# Altium project ShieldBBGaliV.PrjPcb
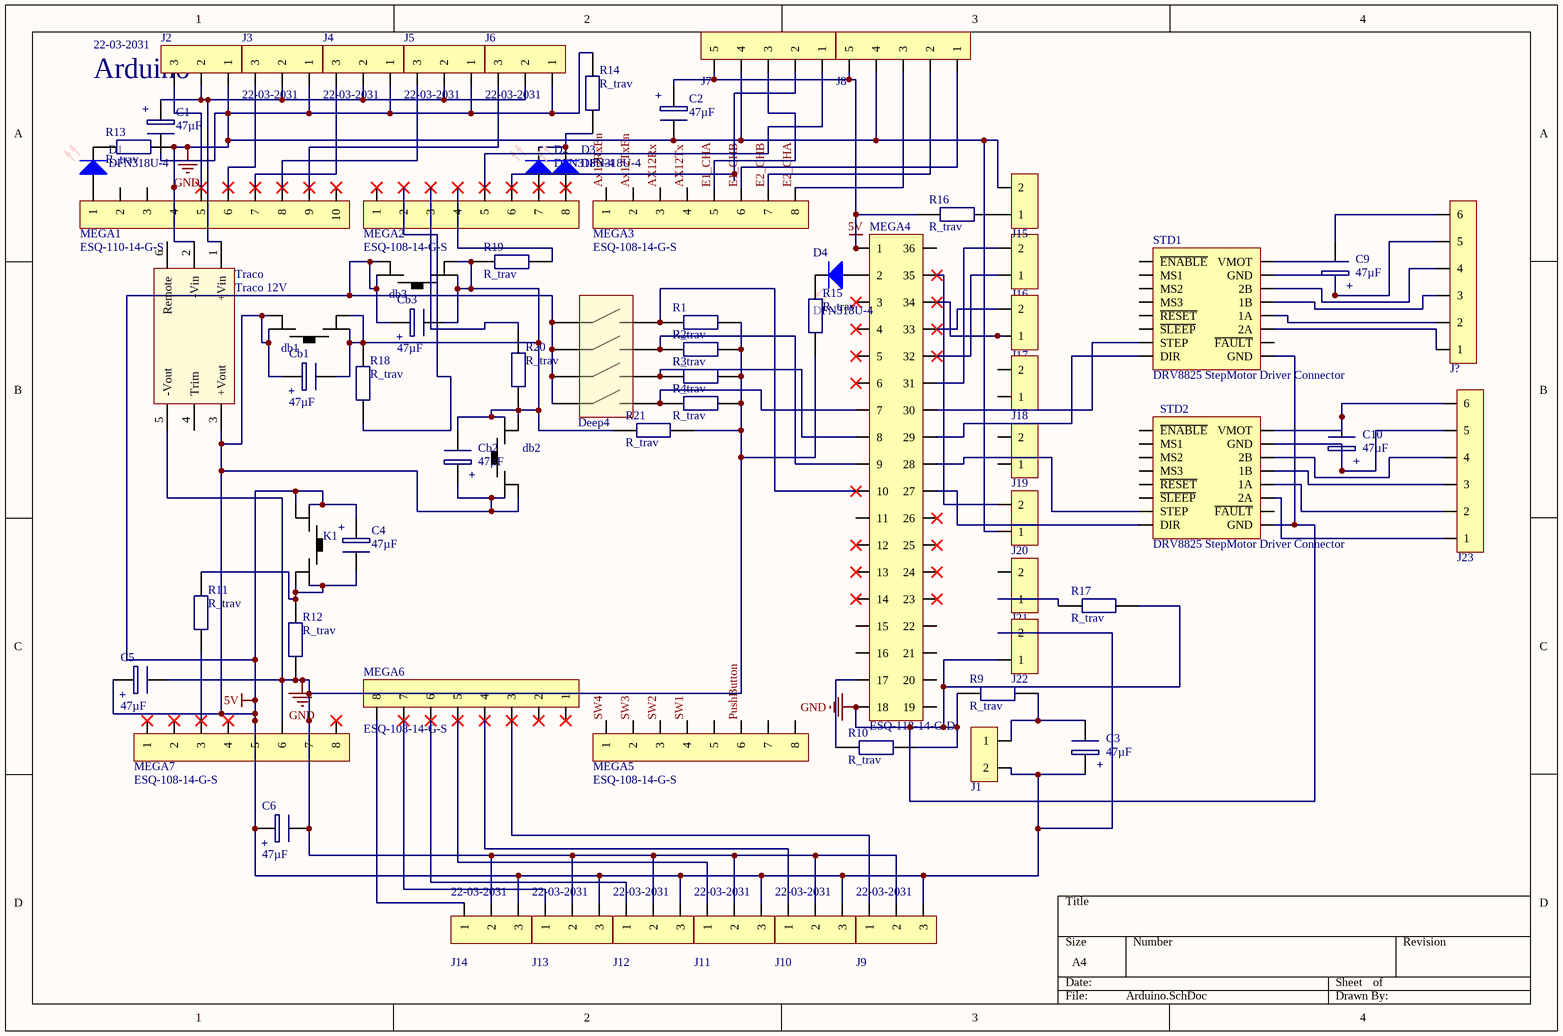
[diagram p0: Arduino.SchDoc]
2 sheets, 98 parts. Net scope: global (net labels, ports and power ports of the same name join across sheets).
Board file: ShieldBBGaliV.PcbDoc
Sheets:
  Arduino.SchDoc
  ActionneursCapteurs.SchDoc

## Sheet Arduino.SchDoc
size A4

### Parts
(Parts that share a designator on the sheet are numbered #1, #2 ... from top to bottom, then left to right.)
C1#1  47µF  [C_5mm]
C2#1  47µF  [C_5mm]
C3#1  47µF  [C_5mm]
C4#1  47µF  [C_5mm]
C5#1  47µF  [C_5mm]
C6#1  47µF  [C_5mm]
C9  47µF  [C_5mm]
C10  47µF  [C_5mm]
Cb1  47µF  [C_5mm]
Cb2  47µF  [C_5mm]
Cb3  47µF  [C_5mm]
D1  DFN318U-4  [DEL]
D2  DFN318U-4  [DEL]
D3  DFN318U-4  [DEL]
D4  DFN318U-4  [DEL]
db1  B3F-1000  [B3F-1000]  (value not drawn)
db2  B3F-1000  [B3F-1000]  (value not drawn)
db3  B3F-1000  [B3F-1000]  (value not drawn)
Deep4  DILx4  [DILx4]  (value not drawn)
J1  22-03-2021  [22-03-2021]  (value not drawn)
J2  22-03-2031  [22-03-2031]
J3  22-03-2031  [22-03-2031]
J4  22-03-2031  [22-03-2031]
J5  22-03-2031  [22-03-2031]
J6  22-03-2031  [22-03-2031]
J7  22-03-2051  [22-03-2051]  (value not drawn)
J8  22-03-2051  [22-03-2051]  (value not drawn)
J9  22-03-2031  [22-03-2031]
J10  22-03-2031  [22-03-2031]
J11  22-03-2031  [22-03-2031]
J12  22-03-2031  [22-03-2031]
J13  22-03-2031  [22-03-2031]
J14  22-03-2031  [22-03-2031]
J15  22-03-2021  [22-03-2021]  (value not drawn)
J16  22-03-2021  [22-03-2021]  (value not drawn)
J17  22-03-2021  [22-03-2021]  (value not drawn)
J18  22-03-2021  [22-03-2021]  (value not drawn)
J19  22-03-2021  [22-03-2021]  (value not drawn)
J20  22-03-2021  [22-03-2021]  (value not drawn)
J21  22-03-2021  [22-03-2021]  (value not drawn)
J22  22-03-2021  [22-03-2021]  (value not drawn)
J23  22-03-2061  [22-03-2061]  (value not drawn)
J?  22-03-2061  [22-03-2061]  (value not drawn)
K1  B3F-1000  [B3F-1000]  (value not drawn)
MEGA1  ESQ-110-14-G-S  [ESQ-110-14-G-S]
MEGA2  ESQ-108-14-G-S  [ESQ-108-14-G-S]
MEGA3  ESQ-108-14-G-S  [ESQ-108-14-G-S]
MEGA4  ESQ-118-14-G-D  [ESQ-118-14-G-D]
MEGA5  ESQ-108-14-G-S  [ESQ-108-14-G-S]
MEGA6  ESQ-108-14-G-S  [ESQ-108-14-G-S]
MEGA7  ESQ-108-14-G-S  [ESQ-108-14-G-S]
R1#1  R_trav  [R_250mW_trav]
R2#1  R_trav  [R_250mW_trav]
R3#1  R_trav  [R_250mW_trav]
R4#1  R_trav  [R_250mW_trav]
R9  R_trav  [R_250mW_trav]
R10  R_trav  [R_250mW_trav]
R11  R_trav  [R_250mW_trav]
R12  R_trav  [R_250mW_trav]
R13#1  R_trav  [R_250mW_trav]
R14#1  R_trav  [R_250mW_trav]
R15#1  R_trav  [R_250mW_trav]
R16#1  R_trav  [R_250mW_trav]
R17  R_trav  [R_250mW_trav]
R18  R_trav  [R_250mW_trav]
R19  R_trav  [R_250mW_trav]
R20  R_trav  [R_250mW_trav]
R21  R_trav  [R_250mW_trav]
STD1  DRV8825 StepMotor Driver Connector  [A4988_Connector_PCB]
STD2  DRV8825 StepMotor Driver Connector  [A4988_Connector_PCB]
Traco  Traco 12V  [THL10WI]

### Nets
5V: C2#1.2 C3#1.2 C4#1.2 C5#1.2 C6#1.2 Cb1.2 Cb2.2 Cb3.2 db1.2 db1.4 db2.1 db2.3 db3.2 db3.4 Deep4.1 Deep4.3 Deep4.5 Deep4.7 J1.2 J7.5 J8.5 J9.3 J10.3 J11.3 J12.3 J13.3 J14.3 J22.2 K1.1 K1.3 MEGA4.1 MEGA7.5 R16#1.2 Traco.3(+Vout)
GND: C1#1.1 C2#1.1 C5#1.1 C6#1.1 J2.1 J3.1 J4.1 J5.1 J6.1 J7.4 J8.4 J9.2 J10.2 J11.2 J12.2 J13.2 J14.2 J15.2 J20.1 J22.1 MEGA1.4 MEGA4.18 MEGA7.6 MEGA7.7 R1#1.1 R2#1.1 R3#1.1 R4#1.1 R9.2 R10.1 R12.2 R13#1.1 R14#1.1 R15#1.2 R17.2 R21.1 STD1.4(GND) STD2.4(GND) Traco.2(-Vin) Traco.5(-Vout)
AX12Rx: MEGA3.3
Ax12RxEn: MEGA3.1
AX12Tx: MEGA3.4
Ax12TxEn: MEGA3.2
E1_CHA: J7.3 MEGA3.5
E1_CHB: J8.1 MEGA3.6
E2_CHA: J8.3 MEGA3.8
E2_CHB: J8.2 MEGA3.7
PushButton: MEGA5.6
SW1: MEGA5.4
SW2: MEGA5.3
SW3: MEGA5.2
SW4: MEGA5.1
NetC1#1_2: C1#1.2 J2.2 J3.2 J4.2 J5.2 J6.2 Traco.1(+Vin)
NetC3#1_1: C3#1.1 J1.1 R9.1
NetC4#1_1: C4#1.1 K1.2 K1.4 R11.1 R12.1
NetC9_1: C9.1 J?.6
NetC9_2: C9.2 J?.5 STD1.4(GND)
NetC10_1: C10.1 J23.6 STD2.2(VMOT)
NetC10_2: C10.2 J23.5 STD2.4(GND)
NetCb1_1: Cb1.1 Cb2.1 Cb3.1 db1.1 db1.3 db2.2 db2.4 db3.1 db3.3 R18.2 R19.2 R20.2 R21.2
NetD1_A: D1.A MEGA1.1
NetD1_K: D1.K R13#1.2
NetD2_A: D2.A MEGA2.7
NetD2_K: D2.K D3.K R14#1.2
NetD3_A: D3.A MEGA2.8
NetD4_A: D4.A MEGA4.2
NetD4_K: D4.K R15#1.1
NetDeep4_2: Deep4.2 MEGA4.10 R1#1.2
NetDeep4_4: Deep4.4 MEGA4.9 R2#1.2
NetDeep4_6: Deep4.6 MEGA4.8 R3#1.2
NetDeep4_8: Deep4.8 MEGA4.7 R4#1.2
NetJ2_3: J2.3 MEGA1.5
NetJ3_3: J3.3 MEGA1.6
NetJ4_3: J4.3 MEGA1.7
NetJ5_3: J5.3 MEGA1.8
NetJ6_3: J6.3 MEGA1.9
NetJ7_1: J7.1 MEGA2.5
NetJ7_2: J7.2 MEGA2.6
NetJ9_1: J9.1 MEGA6.3
NetJ10_1: J10.1 MEGA6.4
NetJ11_1: J11.1 MEGA6.5
NetJ12_1: J12.1 MEGA6.6
NetJ13_1: J13.1 MEGA6.7
NetJ14_1: J14.1 MEGA6.8
NetJ15_1: J15.1 R16#1.1
NetJ16_1: J16.1 MEGA4.32
NetJ16_2: J16.2 MEGA4.31
NetJ17_1: J17.1 MEGA4.34
NetJ17_2: J17.2 MEGA4.33
NetJ20_2: J20.2 MEGA4.35
NetJ21_1: J21.1 R17.1
NetJ23_1: J23.1 STD2.12(2A)
NetJ23_2: J23.2 STD2.10(1A)
NetJ23_3: J23.3 STD2.8(1B)
NetJ23_4: J23.4 STD2.6(2B)
NetJ?_1: J?.1 STD1.12(2A)
NetJ?_2: J?.2 STD1.10(1A)
NetJ?_3: J?.3 STD1.8(1B)
NetJ?_4: J?.4 STD1.6(2B)
NetMEGA2_2: MEGA2.2 R18.1
NetMEGA2_3: MEGA2.3 R20.1
NetMEGA2_4: MEGA2.4 R19.1
NetMEGA4_17: MEGA4.17 R10.2
NetMEGA4_27: MEGA4.27 STD2.15(DIR)
NetMEGA4_28: MEGA4.28 STD2.13(STEP)
NetMEGA4_29: MEGA4.29 STD1.15(DIR)
NetMEGA4_30: MEGA4.30 STD1.13(STEP)
NetMEGA7_3: MEGA7.3 R11.2

Not connected (* = marked no-connect by the designer): J18 1 2; J19 1 2; J21 2; MEGA1 2 3 10*; MEGA2 1*; MEGA4 3* 4* 5* 6* 11 12* 13* 14* 15 16 19 20 21 22 23* 24* 25* 26* 36; MEGA5 5 7 8; MEGA6 1* 2*; MEGA7 1* 2* 4* 8*; STD1 1(~{ENABLE}) 2(VMOT) 3(MS1) 5(MS2) 7(MS3) 9(~{RESET}) 11(~{SLEEP}) 14(~{FAULT}); STD2 1(~{ENABLE}) 3(MS1) 5(MS2) 7(MS3) 9(~{RESET}) 11(~{SLEEP}) 14(~{FAULT}); Traco 4(Trim) 6(Remote)

### Notes on the sheet
- (near J2) Arduino
- (in symbol C_47µF) +

### Library data of the parts
C1#1 C2#1 C3#1 C4#1 C5#1 C6#1 C9 C10 Cb1-Cb3 = C_47µF: Manufacturer: PANASONIC; Manufacturer Part Number: ECA1EM470; Supplier 1: Farnell; Supplier Part Number 1: 1848498; Pricing: 5=0.088, 50=0.085, 100=0.058, 500=0.046, 1000=0.039 (EUR); ComponentLink1URL: http://www.farnell.com/datasheets/1678745.pdf; ComponentLink1Description: http://www.farnell.com/datasheets/1678745.pdf; ComponentLink2URL: http://www.farnell.com/cad/1703907.zip; ComponentLink2Description: http://www.farnell.com/cad/1703907.zip
D1-D4 = DFN318U-4: Through-hole IRED / High Speed Type; Courant: 100 mA; Edition: ECE ZODIAC; Fabriquant: STANLEY; Lien GCC: \\Spar-nas\gcc\Fiches-techniques\CMS\Diodes\; Poid: 0.15 g; Prix: 0.8 €; Puissance: 150 mW; Tension: 5 V; Tr: 10 ns; Type: LED IR; Vd: 1.6 V - 2 V; Angle de diffusion: 20°; Pic de longueur d'onde: 850nm; Semi-conducteur: GaAlAs; Puissance lumineuse: 13 mW; Code_IPC: ?; Code_JEDEC: SOT23; Code_JEITA: ?; Date de création: 13-Juin-2006; Derniére révision: 13-Juin-2006; Référence fabriquant: DFN318U-4
db1-db3 K1 = B3F-1000: Manufacturer: OMRON ELECTRONIC COMPONENTS; Manufacturer Part Number: B3F1006; Force, fonctionnement: 4.9; Tension DC nominale du contact: 24; Courant de contact max.: 50; Terminaisons commutateur: A souder; SVHC: No SVHC (20-Jun-2013); Configuration des contacts: SPST-NO; Hauteur: 4.3; Type d'actionnement: Plate<!--FANDB--><div class="features-and-benefits-container"></div>; Supplier 1: Farnell; Supplier Part Number 1: 1960938; Pricing: 1=0.88, 10=0.72, 25=0.6, 50=0.5, 100=0.46, 200=0.414, 200=0.373, 2000=0.263 (EUR); MSL: -; ComponentLink1URL: http://www.farnell.com/datasheets/611570.pdf; ComponentLink1Description: http://www.farnell.com/datasheets/611570.pdf
Deep4 = DILx4: Manufacturer: MULTICOMP; Manufacturer Part Number: MCNDS-04-V; Supplier 1: Farnell; Supplier Part Number 1: 9471570; Pricing: 1=0.81, 50=0.77, 100=0.72, 500=0.62, 1000=0.57 (EUR); ComponentLink1URL: http://www.farnell.com/cad/1520781.pdf; ComponentLink1Description: http://www.farnell.com/cad/1520781.pdf; ComponentLink2URL: http://www.farnell.com/datasheets/1772997.pdf; ComponentLink2Description: http://www.farnell.com/datasheets/1772997.pdf
J1 J15-J22 = 22-03-2021: Manufacturer: MOLEX; Supplier 1: Farnell; Supplier Part Number 1: 9731075; Manufacturer Part Number: 22-03-2021; Pricing: 10=0.189, 100=0.147, 200=0.119, 500=0.108, 1000=0.088, 2500=0.08, 2500=0.0711, 20000=0.064 (EUR); ComponentLink1URL: http://www.farnell.com/cad/1533907.pdf; ComponentLink1Description: http://www.farnell.com/cad/1533907.pdf; ComponentLink2URL: http://www.farnell.com/datasheets/1791308.pdf; ComponentLink2Description: http://www.farnell.com/datasheets/1791308.pdf
J2-J6 J9-J14 = 22-03-2031: Manufacturer: MOLEX; Supplier 1: Farnell; Supplier Part Number 1: 9731083; Manufacturer Part Number: 22-03-2031; Pricing: 10=0.27, 100=0.242, 200=0.22, 500=0.208, 1000=0.202, 2500=0.196 (EUR); ComponentLink1URL: http://www.farnell.com/cad/1533907.pdf; ComponentLink1Description: http://www.farnell.com/cad/1533907.pdf; ComponentLink2URL: http://www.farnell.com/datasheets/1785732.pdf; ComponentLink2Description: http://www.farnell.com/datasheets/1785732.pdf
J7 J8 = 22-03-2051: Manufacturer: MOLEX; Supplier 1: Farnell; Supplier Part Number 1: 9731105; Manufacturer Part Number: 22-03-2051; Pricing: 10=0.43, 100=0.35, 200=0.29, 500=0.26, 1000=0.24, 2500=0.191, 2500=0.172, 20000=0.155 (EUR); ComponentLink1URL: http://www.farnell.com/cad/1533907.pdf; ComponentLink1Description: http://www.farnell.com/cad/1533907.pdf; ComponentLink2URL: http://www.farnell.com/datasheets/1803075.pdf; ComponentLink2Description: http://www.farnell.com/datasheets/1803075.pdf
J23 J? = 22-03-2061: Manufacturer: MOLEX; Supplier 1: Farnell; Supplier Part Number 1: 9731113; Manufacturer Part Number: 22-03-2061; Pricing: 10=0.76, 100=0.7, 200=0.64, 500=0.49, 1000=0.43, 2500=0.31, 2500=0.304, 20000=0.298 (EUR); ComponentLink1URL: http://www.farnell.com/cad/1533907.pdf; ComponentLink1Description: http://www.farnell.com/cad/1533907.pdf; ComponentLink2URL: http://www.farnell.com/datasheets/1791310.pdf; ComponentLink2Description: http://www.farnell.com/datasheets/1791310.pdf
MEGA1 = ESQ-110-14-G-S: Manufacturer: SAMTEC; Supplier 1: Farnell; Supplier Part Number 1: 1769290; Manufacturer Part Number: ESQ-110-14-G-S; Pricing: 5=4.375, 50=3.012, 100=2.35, 250=1.925, 500=1.75, 2500=1.425 (EUR); ComponentLink1URL: http://www.farnell.com/cad/477214.pdf; ComponentLink1Description: http://www.farnell.com/cad/477214.pdf; ComponentLink2URL: http://www.samtec.com/ftppub/pdf/ESQ_TH.pdf; ComponentLink2Description: http://www.samtec.com/ftppub/pdf/ESQ_TH.pdf
MEGA2 MEGA3 MEGA5-MEGA7 = ESQ-108-14-G-S: Manufacturer: SAMTEC; Supplier 1: Farnell; Supplier Part Number 1: 1769283; Manufacturer Part Number: ESQ-108-14-G-S; Pricing: 5=3.487, 50=2.4, 100=1.875, 250=1.538, 500=1.4, 2500=1.137 (EUR); ComponentLink1URL: http://www.farnell.com/cad/477214.pdf; ComponentLink1Description: http://www.farnell.com/cad/477214.pdf; ComponentLink2URL: http://www.samtec.com/ftppub/pdf/ESQ_TH.pdf; ComponentLink2Description: http://www.samtec.com/ftppub/pdf/ESQ_TH.pdf
MEGA4 = ESQ-118-14-G-D: Manufacturer: SAMTEC; Supplier 1: Farnell; Supplier Part Number 1: 1769197; Manufacturer Part Number: ESQ-118-14-G-D; Pricing: 1=13.413, 10=9.225, 50=6.15, 100=5.475, 250=4.925, 500=4.35 (EUR); ComponentLink1URL: http://www.farnell.com/cad/477214.pdf; ComponentLink1Description: http://www.farnell.com/cad/477214.pdf; ComponentLink2URL: http://www.samtec.com/ftppub/pdf/ESQ_TH.pdf; ComponentLink2Description: http://www.samtec.com/ftppub/pdf/ESQ_TH.pdf
Traco = THN30-2411WI: Traco 5V 30W 6A; Manufacturer: TRACOPOWER; Manufacturer Part Number: THN30-2411WI; Pricing: 1=65.7, 5=63.73, 10=61.82, 25=59.97 (EUR); ComponentLink1URL: http://www.farnell.com/datasheets/1763621.pdf; ComponentLink1Description: http://www.farnell.com/datasheets/1763621.pdf; ComponentLink2URL: http://www.farnell.com/datasheets/1537625.pdf; ComponentLink2Description: http://www.farnell.com/datasheets/1537625.pdf; ComponentLink3URL: http://www.farnell.com/datasheets/1698441.pdf; ComponentLink3Description: http://www.farnell.com/datasheets/1698441.pdf; Supplier 1: Farnell; Supplier Part Number 1: 2322194
STD1 STD2 = DRV8825 StepMotor Driver Connector: ComponentLink1: https://www.pololu.com/product/2133/specs; Supplier 1: Pololu

## Sheet ActionneursCapteurs.SchDoc
size A4
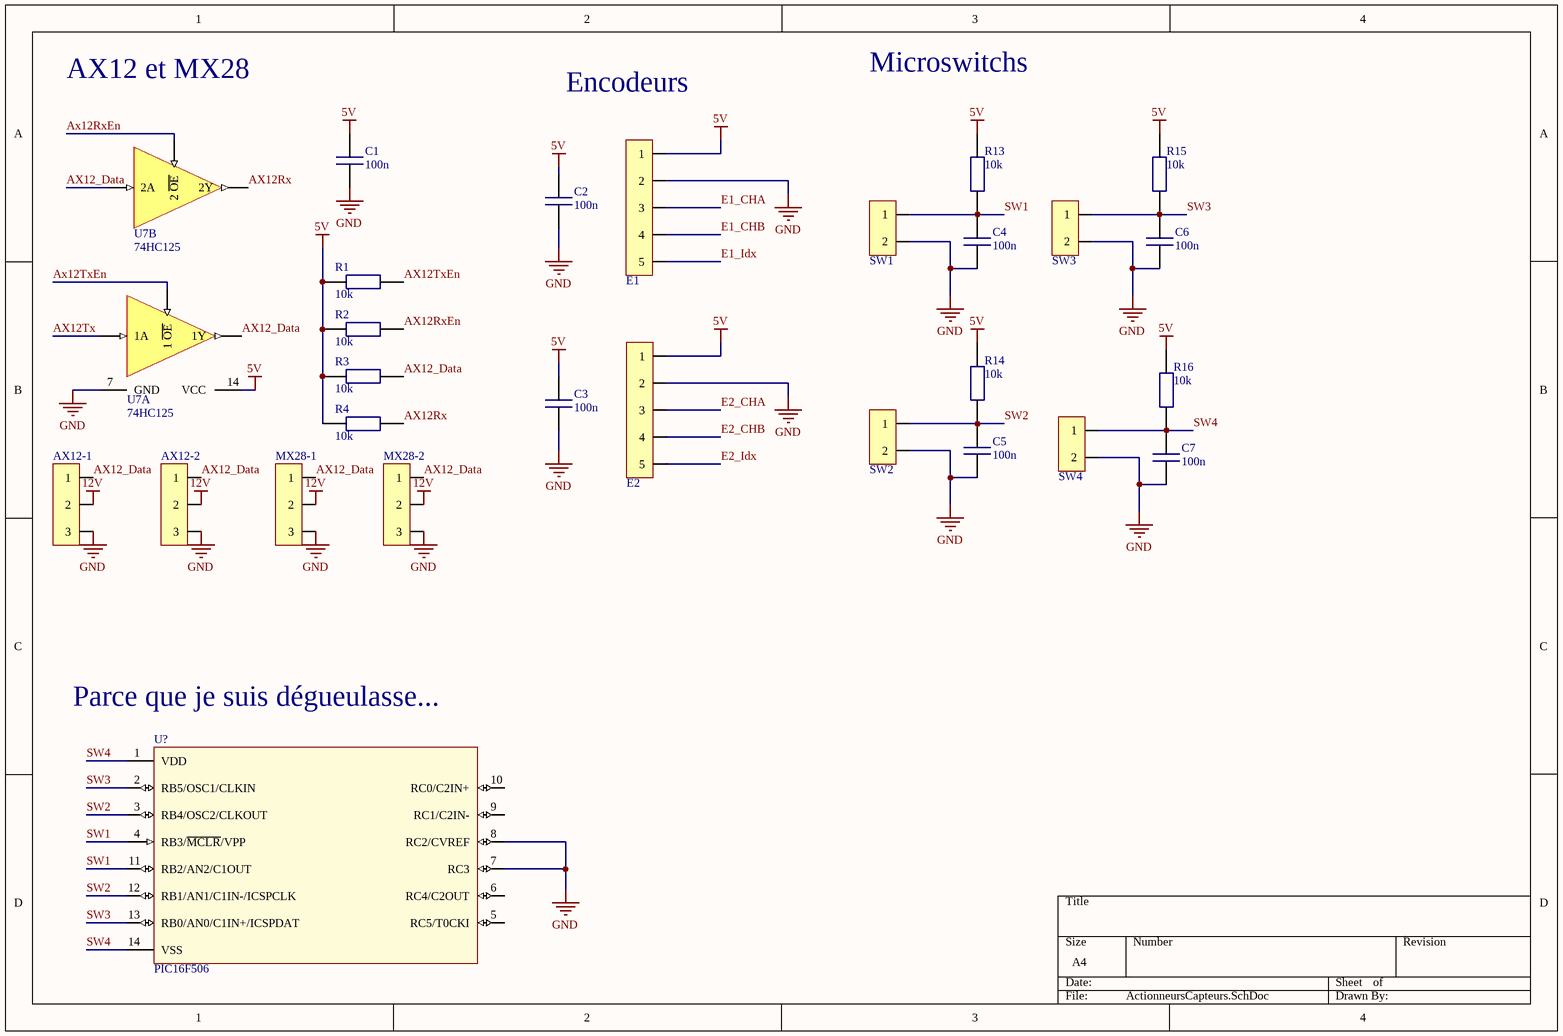
[diagram p1: ActionneursCapteurs.SchDoc]

### Parts
(Parts that share a designator on the sheet are numbered #1, #2 ... from top to bottom, then left to right.)
AX12-1  22-03-2031  [22-03-2031]  (value not drawn)
AX12-2  22-03-2031  [22-03-2031]  (value not drawn)
C1#2  100n  [C_2.54mm]
C2#2  100n  [C_2.54mm]
C3#2  100n  [C_2.54mm]
C4#2  100n  [C_2.54mm]
C5#2  100n  [C_2.54mm]
C6#2  100n  [C_2.54mm]
C7  100n  [C_2.54mm]
E1  22-03-2051  [22-03-2051]  (value not drawn)
E2  22-03-2051  [22-03-2051]  (value not drawn)
MX28-1  22-03-2031  [22-03-2031]  (value not drawn)
MX28-2  22-03-2031  [22-03-2031]  (value not drawn)
R1#2  10k  [R_250mW_trav]
R2#2  10k  [R_250mW_trav]
R3#2  10k  [R_250mW_trav]
R4#2  10k  [R_250mW_trav]
R13#2  10k  [R_250mW_trav]
R14#2  10k  [R_250mW_trav]
R15#2  10k  [R_250mW_trav]
R16#2  10k  [R_250mW_trav]
SW1  22-03-2021  [22-03-2021]  (value not drawn)
SW2  22-03-2021  [22-03-2021]  (value not drawn)
SW3  22-03-2021  [22-03-2021]  (value not drawn)
SW4  22-03-2021  [22-03-2021]  (value not drawn)
U7  74HC125  [DIP14]  (parts A,B of 4)
U?  PIC16F506  [DIP14]

### Nets
5V: C1#2.2 C2#2.2 C3#2.2 E1.1 E2.1 R1#2.2 R2#2.2 R3#2.2 R4#2.2 R13#2.1 R14#2.1 R15#2.1 R16#2.1 U7.14(VCC)
12V: AX12-1.2 AX12-2.2 MX28-1.2 MX28-2.2
GND: AX12-1.3 AX12-2.3 C1#2.1 C2#2.1 C3#2.1 C4#2.1 C5#2.1 C6#2.1 C7.1 E1.2 E2.2 MX28-1.3 MX28-2.3 SW1.2 SW2.2 SW3.2 SW4.2 U7.7(GND) U?.7(RC3) U?.8(RC2/CVREF)
AX12_Data: AX12-1.1 AX12-2.1 MX28-1.1 MX28-2.1 R3#2.1 U7.3(1Y) U7.5(2A)
AX12Rx: R4#2.1 U7.6(2Y)
Ax12RxEn: R2#2.1 U7.4(2_~{OE})
AX12Tx: U7.2(1A)
Ax12TxEn: R1#2.1 U7.1(1_~{OE})
E1_CHA: E1.3
E1_CHB: E1.4
E1_Idx: E1.5
E2_CHA: E2.3
E2_CHB: E2.4
E2_Idx: E2.5
SW1: C4#2.2 R13#2.2 SW1.1 U?.4(RB3/~{MCLR}/VPP) U?.11(RB2/AN2/C1OUT)
SW2: C5#2.2 R14#2.2 SW2.1 U?.3(RB4/OSC2/CLKOUT) U?.12(RB1/AN1/C1IN-/ICSPCLK)
SW3: C6#2.2 R15#2.2 SW3.1 U?.2(RB5/OSC1/CLKIN) U?.13(RB0/AN0/C1IN+/ICSPDAT)
SW4: C7.2 R16#2.2 SW4.1 U?.1(VDD) U?.14(VSS)

Not connected (* = marked no-connect by the designer): U? 5(RC5/T0CKI) 6(RC4/C2OUT) 9(RC1/C2IN-) 10(RC0/C2IN+)

### Notes on the sheet
- AX12 et MX28
- Encodeurs
- Microswitchs
- (near U?) Parce que je suis dégueulasse...

### Library data of the parts
AX12-1 AX12-2 MX28-1 MX28-2 = 22-03-2031: Manufacturer: MOLEX; Supplier 1: Farnell; Supplier Part Number 1: 9731083; Manufacturer Part Number: 22-03-2031; Pricing: 10=0.27, 100=0.242, 200=0.22, 500=0.208, 1000=0.202, 2500=0.196 (EUR); ComponentLink1URL: http://www.farnell.com/cad/1533907.pdf; ComponentLink1Description: http://www.farnell.com/cad/1533907.pdf; ComponentLink2URL: http://www.farnell.com/datasheets/1785732.pdf; ComponentLink2Description: http://www.farnell.com/datasheets/1785732.pdf
C1#2 C2#2 C3#2 C4#2 C5#2 C6#2 C7 = C
E1 E2 = 22-03-2051: Manufacturer: MOLEX; Supplier 1: Farnell; Supplier Part Number 1: 9731105; Manufacturer Part Number: 22-03-2051; Pricing: 10=0.43, 100=0.35, 200=0.29, 500=0.26, 1000=0.24, 2500=0.191, 2500=0.172, 20000=0.155 (EUR); ComponentLink1URL: http://www.farnell.com/cad/1533907.pdf; ComponentLink1Description: http://www.farnell.com/cad/1533907.pdf; ComponentLink2URL: http://www.farnell.com/datasheets/1803075.pdf; ComponentLink2Description: http://www.farnell.com/datasheets/1803075.pdf
R1#2 R2#2 R3#2 R4#2 R13#2 R14#2 R15#2 R16#2 = R_trav
SW1-SW4 = 22-03-2021: Manufacturer: MOLEX; Supplier 1: Farnell; Supplier Part Number 1: 9731075; Manufacturer Part Number: 22-03-2021; Pricing: 10=0.189, 100=0.147, 200=0.119, 500=0.108, 1000=0.088, 2500=0.08, 2500=0.0711, 20000=0.064 (EUR); ComponentLink1URL: http://www.farnell.com/cad/1533907.pdf; ComponentLink1Description: http://www.farnell.com/cad/1533907.pdf; ComponentLink2URL: http://www.farnell.com/datasheets/1791308.pdf; ComponentLink2Description: http://www.farnell.com/datasheets/1791308.pdf
U7 = 74HC125N

## Nets that join several sheets
5V: Arduino (34 pins), ActionneursCapteurs (14 pins)
GND: Arduino (40 pins), ActionneursCapteurs (20 pins)
AX12Rx: Arduino (MEGA3.3), ActionneursCapteurs (R4#2.1 U7.6)
Ax12RxEn: Arduino (MEGA3.1), ActionneursCapteurs (R2#2.1 U7.4)
AX12Tx: Arduino (MEGA3.4), ActionneursCapteurs (U7.2)
Ax12TxEn: Arduino (MEGA3.2), ActionneursCapteurs (R1#2.1 U7.1)
E1_CHA: Arduino (J7.3 MEGA3.5), ActionneursCapteurs (E1.3)
E1_CHB: Arduino (J8.1 MEGA3.6), ActionneursCapteurs (E1.4)
E2_CHA: Arduino (J8.3 MEGA3.8), ActionneursCapteurs (E2.3)
E2_CHB: Arduino (J8.2 MEGA3.7), ActionneursCapteurs (E2.4)
SW1: Arduino (MEGA5.4), ActionneursCapteurs (5 pins)
SW2: Arduino (MEGA5.3), ActionneursCapteurs (5 pins)
SW3: Arduino (MEGA5.2), ActionneursCapteurs (5 pins)
SW4: Arduino (MEGA5.1), ActionneursCapteurs (5 pins)